# Altium schematic sheet _Controller.SchDoc
size A3
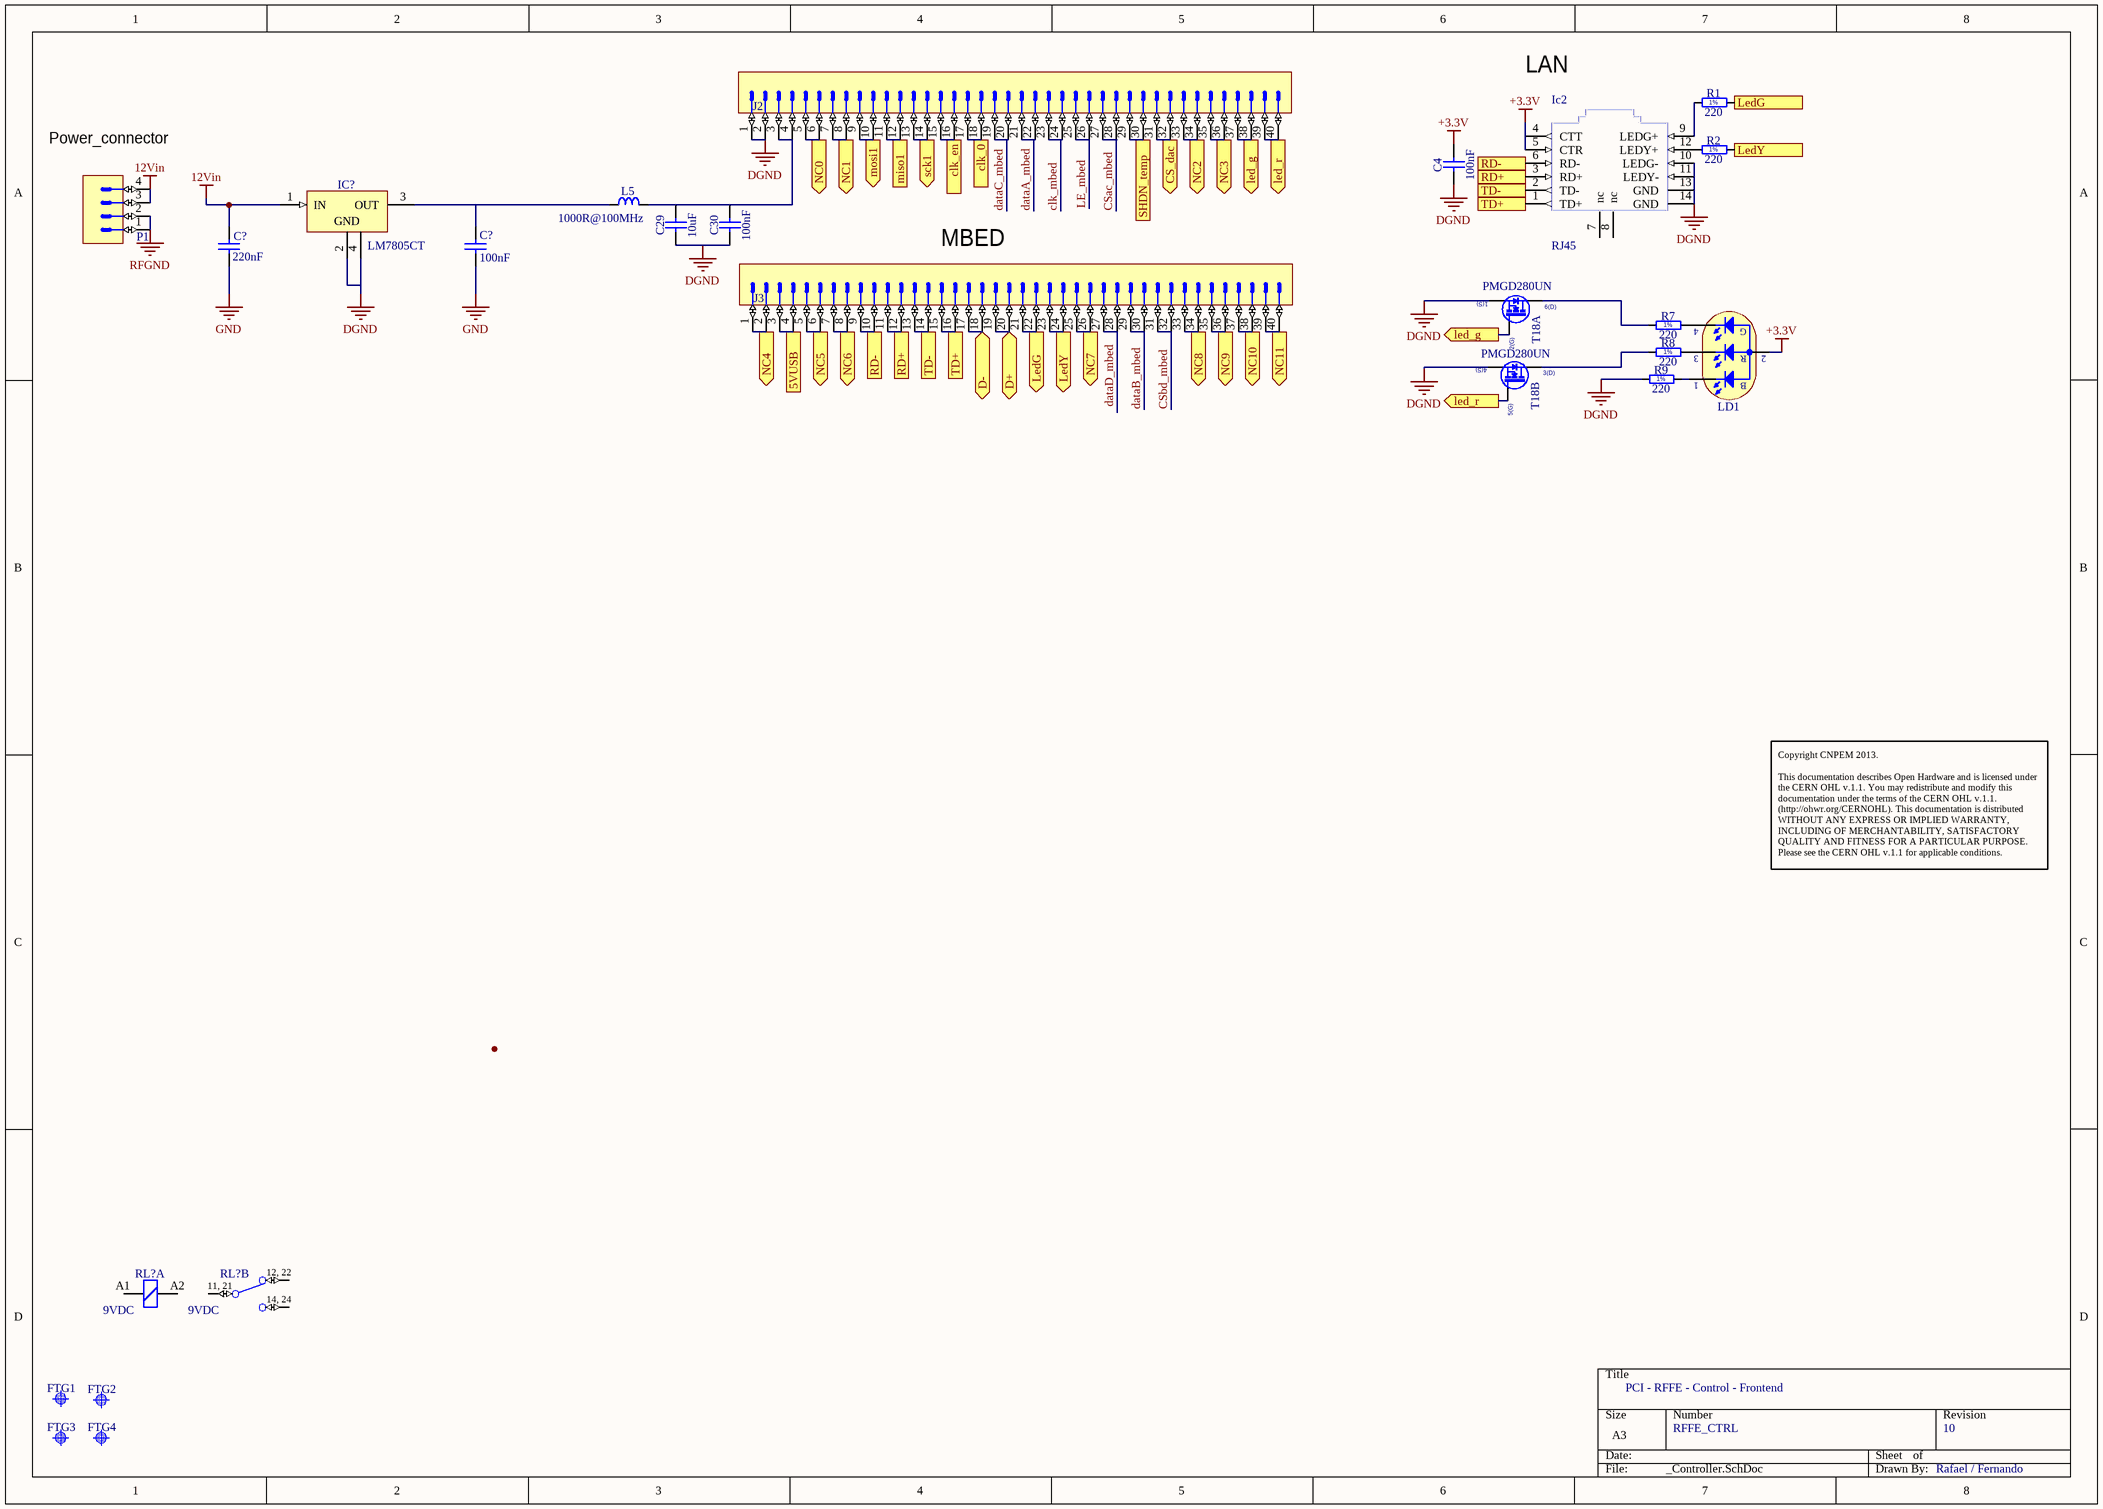
[diagram p0: _Controller.SchDoc]

## Parts
(Parts that share a designator on the sheet are numbered #1, #2 ... from top to bottom, then left to right.)
C4  100nF  [CAPC1608X87N]
C29  10uF  [CAPC3216X180N]
C30  100nF  [CAPC1608X87N]
C?#1  220nF  [CAPR500-250X720X650]
C?#2  100nF  [CAPR500-250X720X650]
FTG1  Use only in PCB  [FIDUCIAL_TOP_S100-200]  (value not drawn)
FTG2  Use only in PCB  [FIDUCIAL_TOP_S100-200]  (value not drawn)
FTG3  Use only in PCB  [FIDUCIAL_TOP_S100-200]  (value not drawn)
FTG4  Use only in PCB  [FIDUCIAL_TOP_S100-200]  (value not drawn)
Ic2  RJ45  [J0006D21BNL]
IC?  LM7805CT  [TO-220-H]
J2  (no value)  [TYCO_2-534998-0]
J3  (no value)  [TYCO_2-534998-0]
L5  1000R@100MHz  [INDC1608X95N]
LD1  Blue/Red/Green  [LED_AVAGO_HSMF-C113]  (value not drawn)
P1  Header 4  [JST_B4B-XH-A(LF)(SN)]  (value not drawn)
R1  220  [RESC2012X60N]
R2  220  [RESC2012X60N]
R7  220  [RESC2012X60N]
R8  220  [RESC2012X60N]
R9  220  [RESC2012X60N]
RL?#1  9VDC  [REL_FINDER_40.61]  (part A of 2)
RL?#2  9VDC  [REL_FINDER_40.61]  (part B of 2)
T18  PMGD280UN  [SOT65P210X110-6N]  (parts A,B of 2)

## Ports
5VUSB, clk_0, clk_en, CS_dac (out), D+ (bidir), D- (bidir), led_g (out), led_r (out), LedG, LedG (out), LedY, LedY (out), miso1, mosi1 (out), NC0 (out), NC1 (out), NC2 (out), NC3 (out), NC4 (out), NC5 (out), NC6 (out), NC7 (out), NC8 (out), NC9 (out), NC10 (out), NC11 (out), RD+, RD-, sck1 (out), SHDN_temp, TD+, TD-

## Nets
12Vin: C?#1.2 IC?.1(IN) P1.3 P1.4
+3.3V: C4.2 Ic2.4(CTT) Ic2.5(CTR) LD1.2(AC)
DGND: C4.1 C29.1 C30.1 Ic2.10(LEDG-) Ic2.11(LEDY-) Ic2.13(GND) Ic2.14(GND) IC?.2(GND) IC?.4(GND) J2.1 J2.2 R9.1 T18.1(S) T18.4(S)
GND: C?#1.1 C?#2.1
RFGND: P1.1 P1.2
5VUSB: J3.3 J3.4 ; port 5VUSB
clk_0: J2.17 J2.18 ; port clk_0
clk_en: J2.15 J2.16 ; port clk_en
clk_mbed: J2.23 J2.24
CS_dac: J2.31 J2.32 ; port CS_dac
CSac_mbed: J2.27 J2.28
CSbd_mbed: J3.31 J3.32
D+: J3.19 J3.20 ; port D+
D-: J3.17 J3.18 ; port D-
dataA_mbed: J2.21 J2.22
dataB_mbed: J3.29 J3.30
dataC_mbed: J2.19 J2.20
dataD_mbed: J3.27 J3.28
LE_mbed: J2.25 J2.26
led_g: J2.37 J2.38 T18.2(G) ; port led_g
led_r: J2.39 J2.40 T18.5(G) ; port led_r
LedG: J3.21 J3.22 R1.2 ; port LedG
LedY: J3.23 J3.24 R2.2 ; port LedY
miso1: J2.11 J2.12 ; port miso1
mosi1: J2.9 J2.10 ; port mosi1
NC0: J2.5 J2.6 ; port NC0
NC1: J2.7 J2.8 ; port NC1
NC2: J2.33 J2.34 ; port NC2
NC3: J2.35 J2.36 ; port NC3
NC4: J3.1 J3.2 ; port NC4
NC5: J3.5 J3.6 ; port NC5
NC6: J3.7 J3.8 ; port NC6
NC7: J3.25 J3.26 ; port NC7
NC8: J3.33 J3.34 ; port NC8
NC9: J3.35 J3.36 ; port NC9
NC10: J3.37 J3.38 ; port NC10
NC11: J3.39 J3.40 ; port NC11
RD+: Ic2.3(RD+) J3.11 J3.12 ; port RD+
RD-: Ic2.6(RD-) J3.9 J3.10 ; port RD-
sck1: J2.13 J2.14 ; port sck1
SHDN_temp: J2.29 J2.30 ; port SHDN_temp
TD+: Ic2.1(TD+) J3.15 J3.16 ; port TD+
TD-: Ic2.2(TD-) J3.13 J3.14 ; port TD-
NetC29_2: C29.2 C30.2 J2.3 J2.4 L5.2
NetC?#2_2: C?#2.2 IC?.3(OUT) L5.1
NetIc2_9: Ic2.9(LEDG+) R1.1
NetIc2_12: Ic2.12(LEDY+) R2.1
NetLD1_1: LD1.1(CB) R9.2
NetLD1_3: LD1.3(CR) R8.2
NetLD1_4: LD1.4(CG) R7.2
NetR7_1: R7.1 T18.6(D)
NetR8_1: R8.1 T18.3(D)
NetRL?#2_11: RL?#2.11(C) RL?#2.21(C)
NetRL?#2_12: RL?#2.12(NC) RL?#2.22(NC)
NetRL?#2_14: RL?#2.14(NO) RL?#2.24(NO)

Not connected (* = marked no-connect by the designer): Ic2 7(nc) 8(nc); RL?#1 A1(COIL) A2(COIL)

## Notes on the sheet
- LAN
- (near P1) Power_connector
- (near J3) MBED
- Copyright CNPEM 2013.
  This documentation describes Open Hardware and is licensed under the CERN OHL v.1.1. You may redistribute and modify this documentation under the terms of the CERN OHL v.1.1. (http://ohwr.org/CERNOHL). This documentation is distributed WITHOUT ANY EXPRESS OR IMPLIED WARRANTY, INCLUDING OF MERCHANTABILITY, SATISFACTORY QUALITY AND FITNESS FOR A PARTICULAR PURPOSE. Please see the CERN OHL v.1.1 for applicable conditions.
- PCI - RFFE - Control - Frontend
- RFFE_CTRL
- 10
- Rafael / Fernando
- (in symbol LED_AVAGO_HSMF-C113) G; R; B
- (in symbol PMGD280UN, part A) 6(D); 1(S); 2(G)
- (in symbol PMGD280UN, part B) 3(D); 4(S); 5(G)
- (in symbol R0805_220R_1%_0.125W_100PPM) 1%
- (in symbol REL_FINDER_40.61.9.009.0000, part B) 12, 22; 11, 21; 14, 24

## Library data of the parts
C4 C30 = CC0603_100NF_50V_10%_X7R: Non-polarised capacitor; Manufacturer: GENERIC; Part Description: SMD Multilayer Chip Ceramic Capacitor; Manufacturer1 Part Number: 223858615649; Tolerance: ±10%; Voltage: 50V; TC: X7R; Manufacturer Part Number: CC0603_100NF_50V_10%_X7R; Part Number: CC0603_100NF_50V_10%_X7R; Component Kind: Standard; Component Type: Standard; Pin Count: 2; Value: 100nF; Status: Preferred; Case: 0603; Mounted: Yes; Socket: No; SMD: Yes; Sense: No; Manufacturer1 Example: PHYCOMP; Manufacturer1 ComponentHeight: 0.87mm; HelpURL: \\cern.ch\dfs\Applications\Altium\Datasheets\CC0603_X7R_PHYCOMP.pdf; Author: CERN DEM JLC; CreateDate: 03/12/2007; LatestRevisionDate: 03/12/2007
C29 = CC1206_10UF_25V_10%_X7R: Non-polarised capacitor; Manufacturer: GENERIC; Part Description: SMD Multilayer Chip Ceramic Capacitor; Manufacturer1 Part Number: C1206C106K4RACTU; Tolerance: ±10%; Voltage: 25V; TC: X7R; Manufacturer Part Number: CC1206_10uF_25V_10%_X7R; Part Number: CC1206_10UF_25V_10%_X7R; Component Kind: Standard; Component Type: Standard; Pin Count: 2; Value: 10uF; Status: Preferred; Case: 1206; Mounted: Yes; Socket: No; SMD: Yes; Sense: No; Manufacturer1 Example: KEMET; Manufacturer1 ComponentHeight: 1.8mm; HelpURL: \\cern.ch\dfs\Applications\Altium\Datasheets\CC1206_X7R_KEMET.pdf; Author: CERN DEM JLC; CreateDate: 12/09/2012; LatestRevisionDate: 12/09/2012
C?#1 = CPER_220NF_63V_10%_500-250X720X650: Non-polarised capacitor; Part Description: Metallized Polyester Film Capacitor (MKT); Manufacturer: TDK; Manufacturer Part Number: B32529C0224K000; Voltage: 63VDC/40VAC; Tolerance: ±10%; Part Number: CPER_220NF_63V_10%_500-250X720X650; Component Kind: Standard; Component Type: Standard; Pin Count: 2; Value: 220nF; Status: None; Case: LS5 W2.5 x L7.2 x H6.5; Mounted: Yes; Socket: No; SMD: No; Sense: No; ComponentHeight: 6.5mm; HelpURL: \\cern.ch\dfs\Applications\Altium\Datasheets\CPER_TDK_B32529.pdf; Author: CERN DEM JLC; CreateDate: 19/12/2007; LatestRevisionDate: 22/04/2015
C?#2 = CPER_100NF_63V_10%_500-250X720X650: Non-polarised capacitor; Part Description: Metallized Polyester Film Capacitor (MKT); Manufacturer: TDK; Manufacturer Part Number: B32529C0104K000; Voltage: 63VDC/40VAC; Tolerance: ±10%; Part Number: CPER_100NF_63V_10%_500-250X720X650; Component Kind: Standard; Component Type: Standard; Pin Count: 2; Value: 100nF; Status: None; Case: LS5 W2.5 x L7.2 x H6.5; Mounted: Yes; Socket: No; SMD: No; Sense: No; ComponentHeight: 6.5mm; HelpURL: \\cern.ch\dfs\Applications\Altium\Datasheets\CPER_TDK_B32529.pdf; Author: CERN DEM JLC; CreateDate: 19/12/2007; LatestRevisionDate: 19/12/2007
FTG1-FTG4 = FIDUCIAL_TARGET_S100-200: Fiducial Target; Part Description: Square Fiducial Target, Top Layer, 1.0mm, Top Solder 2.0mm, Keepout =2.0mm; Mounted: No; Part Number: FIDUCIAL_TARGET_S100-200; Component Kind: Standard (No BOM); Component Type: Standard (No BOM); Pin Count: 1; Family: Fiducial; Socket: No; SMD: Yes; Sense: No; Status: None; ComponentHeight: 0mm; HelpURL: Undefined; Author: CERN DEM JLC; CreateDate: 09/02/2010; LatestRevisionDate: 04/04/2012; PackageDescription: Square Fiducial Target, Top Layer, 1.0mm, Top Solder 2.0mm, Keepout =2.0mm
Ic2 = J0006D21BNL: CONN MAGJACK 1PORT 100 BASE-TX; Manufacturer: Pulse Electronics Corporation; Part Description: 1 Port, 1x1 Tab-Down 10/100BASE-TX RJ45 FastJack Connector Module With LEDs Y/G; Number of Ports: 1; LED Color: Green - Yellow; Number of Cores per Jack: 4; Shielding: Shielded; Tab Direction: Down; Shield Material: Brass; PressFit: No; Supplier 1: Digi-Key; Manufacturer Part Number: J0006D21BNL; RoHS: RoHS Compliant; Category: Connectors, Interconnects; Stock 1: 1565; Pricing 1: 1=6.38, 25=5.586, 50=5.32, 100=5.054, 250=4.522, 500=4.256, 1000=3.724, 2500=3.5378, 5000=3.458 (USD); Packaging: Bulk; Connector Type: RJ45; Number of Rows: 1; Applications: 10/100 Base-TX, AutoMDIX; Mounting Type: Through Hole; Orientation: 90° Angle (Right); Termination: Solder; Height Above Board: 0.545" (13.84mm); Features: Board Guide; Contact Material: Phosphor Bronze; Contact Finish: Gold; Contact Finish Thickness: 15µin (0.38µm); Housing Material: Thermoplastic; Operating Temperature: 0°C ~ 70°C; ComponentLink1URL: http://productfinder.pulseeng.com/products/datasheets/J403.pdf; ComponentLink1Description: http://productfinder.pulseeng.com/products/datasheets/J403.pdf; Supplier Part Number 1: J0006D21BNL; Part Number: J0006D21BNL; Component Kind: Standard; Component Type: Standard; Pin Count: 16; Family: RJ45; Mounted: Yes; Socket: No; SMD: No; Sense: No; Status: None; ComponentHeight: 13.84mm; HelpURL: http://productfinder.pulseeng.com/products/datasheets/J403.pdf; Author: LNLS DIG FCS; CreateDate: 28/06/2016; LatestRevisionDate: 28/06/2016
IC? = LM7805CT_h: 3-Terminal Regulator 1=IN 2=GND 3=OUT 4=GND; Part Description: 3-Terminal 5V 1A Positive Voltage Regulator; Manufacturer: FAIRCHILD SEMICONDUCTOR; PressFit: No; Bonding: No; Part Number: LM7805CT_h; Component Kind: Standard; Component Type: Standard; Device: LM7805CT; PackageDescription: TO-220 3-Terminal + Tab - Horizontal Mount; Manufacturer Part Number: LM7805CT; Pin Count: 4; Case: TO-220; Mounted: Yes; Socket: No; SMD: No; Sense: No; ComponentHeight: 4.7mm; HelpURL: \\cern.ch\dfs\Applications\Altium\Datasheets\LM7805CT.pdf; Author: CERN DEM JLC; CreateDate: 18/03/2008; LatestRevisionDate: 18/03/2008
J2 J3 = TYCO_2-534998-0: Connector 40 Male; Part Description: 40 Contacts, Vertical Low Profile IDC Shrouded Header with Ejection Latches; Manufacturer: TYCO ELECTRONICS; PressFit: No; Part Number: TYCO_2-534998-0; Component Kind: Standard; Component Type: Standard; Pin Count: 40; Family: AMP-LATCH; Mounted: Yes; Socket: No; SMD: No; Sense: No; Status: None; Manufacturer Part Number: 2-534998-0; ComponentHeight: 6.22mm; HelpURL: http://www.te.com/commerce/DocumentDelivery/DDEController?Action=srchrtrv&DocNm=534998&DocType=Customer+Drawing&DocLang=English; Author: LNLS DIG FCS; CreateDate: 28/06/2016; LatestRevisionDate: 28/06/2016
L5 = IND0603_MURATA_BLM18HE102SN1: Inductor; Part Description: SMD EMIFIL Suppression Chip Ferrite Bead; Manufacturer: MURATA; Power: 600mA; Resistance: 0.35R; Tolerance: ±25%; Part Number: IND0603_MURATA_BLM18HE102SN1; Component Kind: Standard; Component Type: Standard; Pin Count: 2; Value: 1000R@100MHz; Status: None; Manufacturer Part Number: BLM18HE102SN1; Case: 0603; Mounted: Yes; Socket: No; SMD: Yes; Sense: No; ComponentHeight: 0.95mm; HelpURL: \\cern.ch\dfs\Applications\Altium\Datasheets\IND0603_MURATA_BLM18H.pdf; Author: CERN DEM JLC; CreateDate: 09/12/2013; LatestRevisionDate: 09/12/2013
LD1 = LED_AVAGO_HSMF-C113: Tricolor LEDs 1 Cathode Blue, 2 Common Anode, 3 Cathode Red, 4 Cathode Green; Part Description: Right Angle Tricolor (Blue, Red, Green) Surface Mount ChipLED; Manufacturer: AVAGO TECHNOLOGIES; PressFit: No; Bonding: No; Part Number: LED_AVAGO_HSMF-C113; Component Kind: Standard; Component Type: Standard; Color: Blue/Red/Green; PackageDescription: Right Angle Tricolor Surface Mount ChipLED, Body 2.5x1mm; Manufacturer Part Number: HSMF-C113; Pin Count: 4; Mounted: Yes; Socket: No; SMD: Yes; Sense: No; ComponentHeight: 1mm; HelpURL: \\cern.ch\dfs\Applications\Altium\Datasheets\LED_AVAGO_HSMF-C113.pdf; Author: CERN DEM JLC; CreateDate: 29/09/2010; LatestRevisionDate: 29/09/2010
P1 = JST_B4B-XH-A(LF)(SN): Connector 4 Male; Part Description: 4 Contacts, 2.5mm Pitch, Top Entry Type Shrouded Header; Manufacturer: JST (JAPAN SOLDERLESS TERMINALS); PressFit: No; LatestRevisionDate: 14/08/2014; Part Number: JST_B4B-XH-A(LF)(SN); Component Kind: Standard; Component Type: Standard; Pin Count: 4; Family: Header 4; Mounted: Yes; Socket: No; SMD: No; Sense: No; Status: None; Manufacturer Part Number: B4B-XH-A(LF)(SN); ComponentHeight: 7mm; HelpURL: \\cern.ch\dfs\Applications\Altium\Datasheets\JST_B4B-XH-A(LF)(SN).pdf; Author: CERN DEM JLC; CreateDate: 14/08/2014
R1 R2 R7-R9 = R0805_220R_1%_0.125W_100PPM: Resistor - 1%; Manufacturer: GENERIC; Part Description: General Purpose Thick Film Chip Resistor; Manufacturer1 Part Number: NRC10F2200TRF; Power: 0.125W; TC: ±100ppm/°C; Manufacturer Part Number: R0805_220R_1%_0.125W_100PPM; Tolerance: ±1%; Part Number: R0805_220R_1%_0.125W_100PPM; Component Kind: Standard; Component Type: Standard; Pin Count: 2; Value: 220; Status: Preferred; Case: 0805; Mounted: Yes; Sense: No; Socket: No; SMD: Yes; Manufacturer1 Example: NIC COMPONENT; Manufacturer1 ComponentHeight: 0.6mm; HelpURL: \\cern.ch\dfs\Applications\Altium\Datasheets\R0805_NIC_NRC.pdf; Author: CERN DEM JLC; CreateDate: 03/12/2007; LatestRevisionDate: 13/03/2008
RL?#1 RL?#2 = REL_FINDER_40.61.9.009.0000: 16A SPDT PCB Relay, 40.61 Serie; Part Description: 16A, SPDT PCB Relay, 40 Series; Manufacturer: FINDER; PressFit: No; Part Number: REL_FINDER_40.61.9.009.0000; Component Kind: Standard; Component Type: Standard; Pin Count: 8; PackageDescription: 8 Leads, 1 Pole 16A Relay, FINDER 40.61Serie, Body 29mm x 12.4mm; Mounted: Yes; Socket: No; SMD: No; Sense: No; Status: None; Value: 9VDC; Manufacturer Part Number: 40.61.9.009.0000; ComponentHeight: 25mm; HelpURL: \\cern.ch\dfs\Applications\Altium\Datasheets\REL_FINDER_40.61.pdf; Author: CERN DEM JLC; CreateDate: 06/08/2012; LatestRevisionDate: 06/08/2012
T18 = PMGD280UN: Dual N-Channel micro TrenchMOS™ Ultra Low Level FET; Part Description: 20V 870mA Dual N-Channel micro TrenchMOS™ Ultra Low Level FET; Manufacturer: NXP SEMICONDUCTORS; PressFit: No; Bonding: No; Part Number: PMGD280UN; Component Kind: Standard; Component Type: Standard; Device: PMGD280UN; PackageDescription: SOT363, SC70-6, SOT, 0.65mm Pitch, 6 pin, 1.25mm W X 2.00mm L X 1.10mm H, IPC Medium Density; Manufacturer Part Number: PMGD280UN; Pin Count: 6; Case: SOT363; Mounted: Yes; Socket: No; SMD: Yes; Sense: No; ComponentHeight: 1.1mm; HelpURL: \\cern.ch\dfs\Applications\Altium\Datasheets\PMGD280UN.pdf; Author: CERN DEM JLC; CreateDate: 19/11/2014; LatestRevisionDate: 19/11/2014